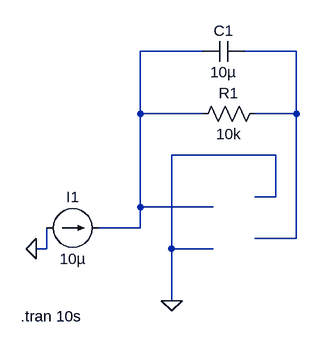
[diagram p0: schematic Draft1.asc]
Draft1.asc, the LTspice schematic file:
Version 4
SHEET 1 880 680
WIRE 352 -112 256 -112
WIRE 496 -112 416 -112
WIRE 256 -16 256 -112
WIRE 352 -16 256 -16
WIRE 496 -16 496 -112
WIRE 496 -16 432 -16
WIRE 464 48 304 48
WIRE 464 112 464 48
WIRE 464 112 432 112
WIRE 256 128 256 -16
WIRE 368 128 256 128
WIRE 256 160 256 128
WIRE 256 160 192 160
WIRE 496 176 496 -16
WIRE 496 176 432 176
WIRE 112 192 112 160
WIRE 112 192 96 192
WIRE 304 192 304 48
WIRE 368 192 304 192
WIRE 304 272 304 192
FLAG 96 192 0
FLAG 304 272 0
SYMBOL current 112 160 R270
WINDOW 0 32 40 VTop 2
WINDOW 3 -32 40 VBottom 2
WINDOW 123 0 0 Left 0
WINDOW 39 0 0 Left 0
SYMATTR InstName I1
SYMATTR Value 10µ
SYMBOL res 448 -32 R90
WINDOW 0 0 56 VBottom 2
WINDOW 3 32 56 VTop 2
SYMATTR InstName R1
SYMATTR Value 10k
SYMBOL cap 416 -128 R90
WINDOW 0 0 32 VBottom 2
WINDOW 3 32 32 VTop 2
SYMATTR InstName C1
SYMATTR Value 10µ
TEXT 72 296 Left 2 !.tran 10s

The netlist it stands for:
* Draft1.asc
I1 0 N001 10µ
R1 N002 N001 10k
C1 N002 N001 10µ
.tran 10s
.backanno
.end